# EAGLE board CNC (EAGLE 9.2.0)
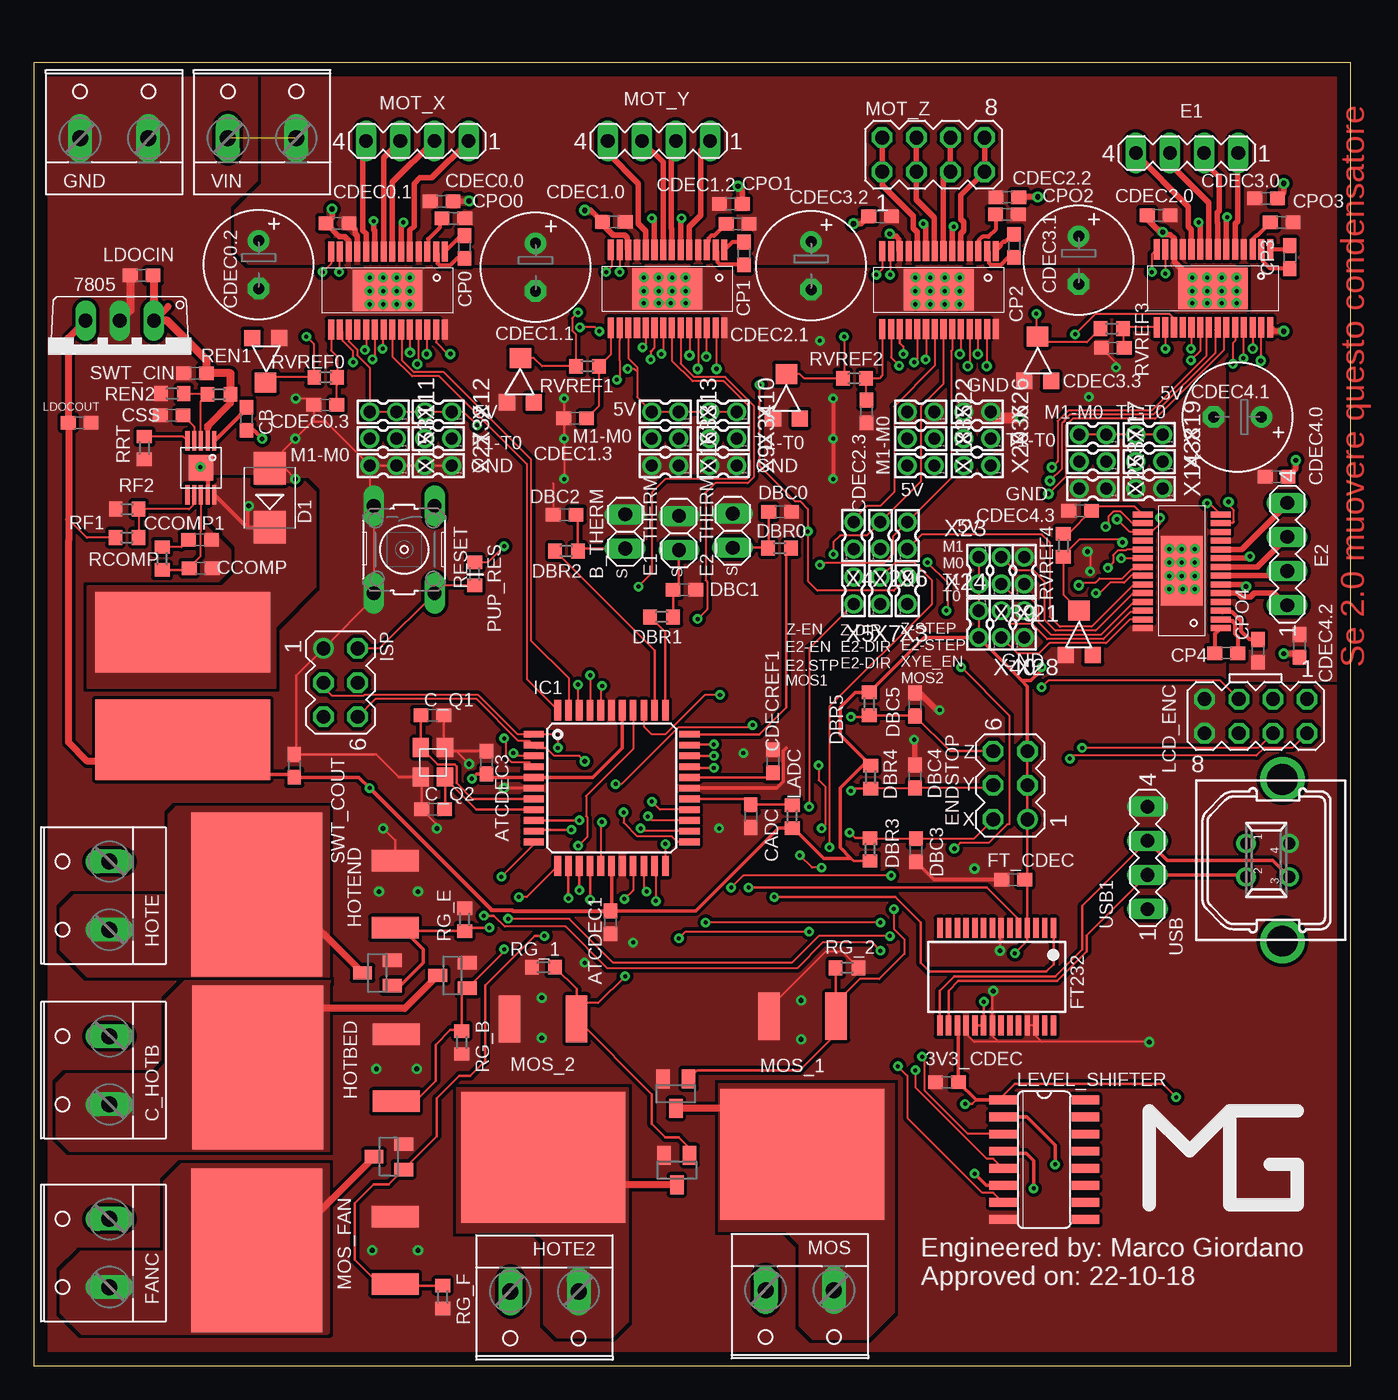
[diagram p2: board, top side]
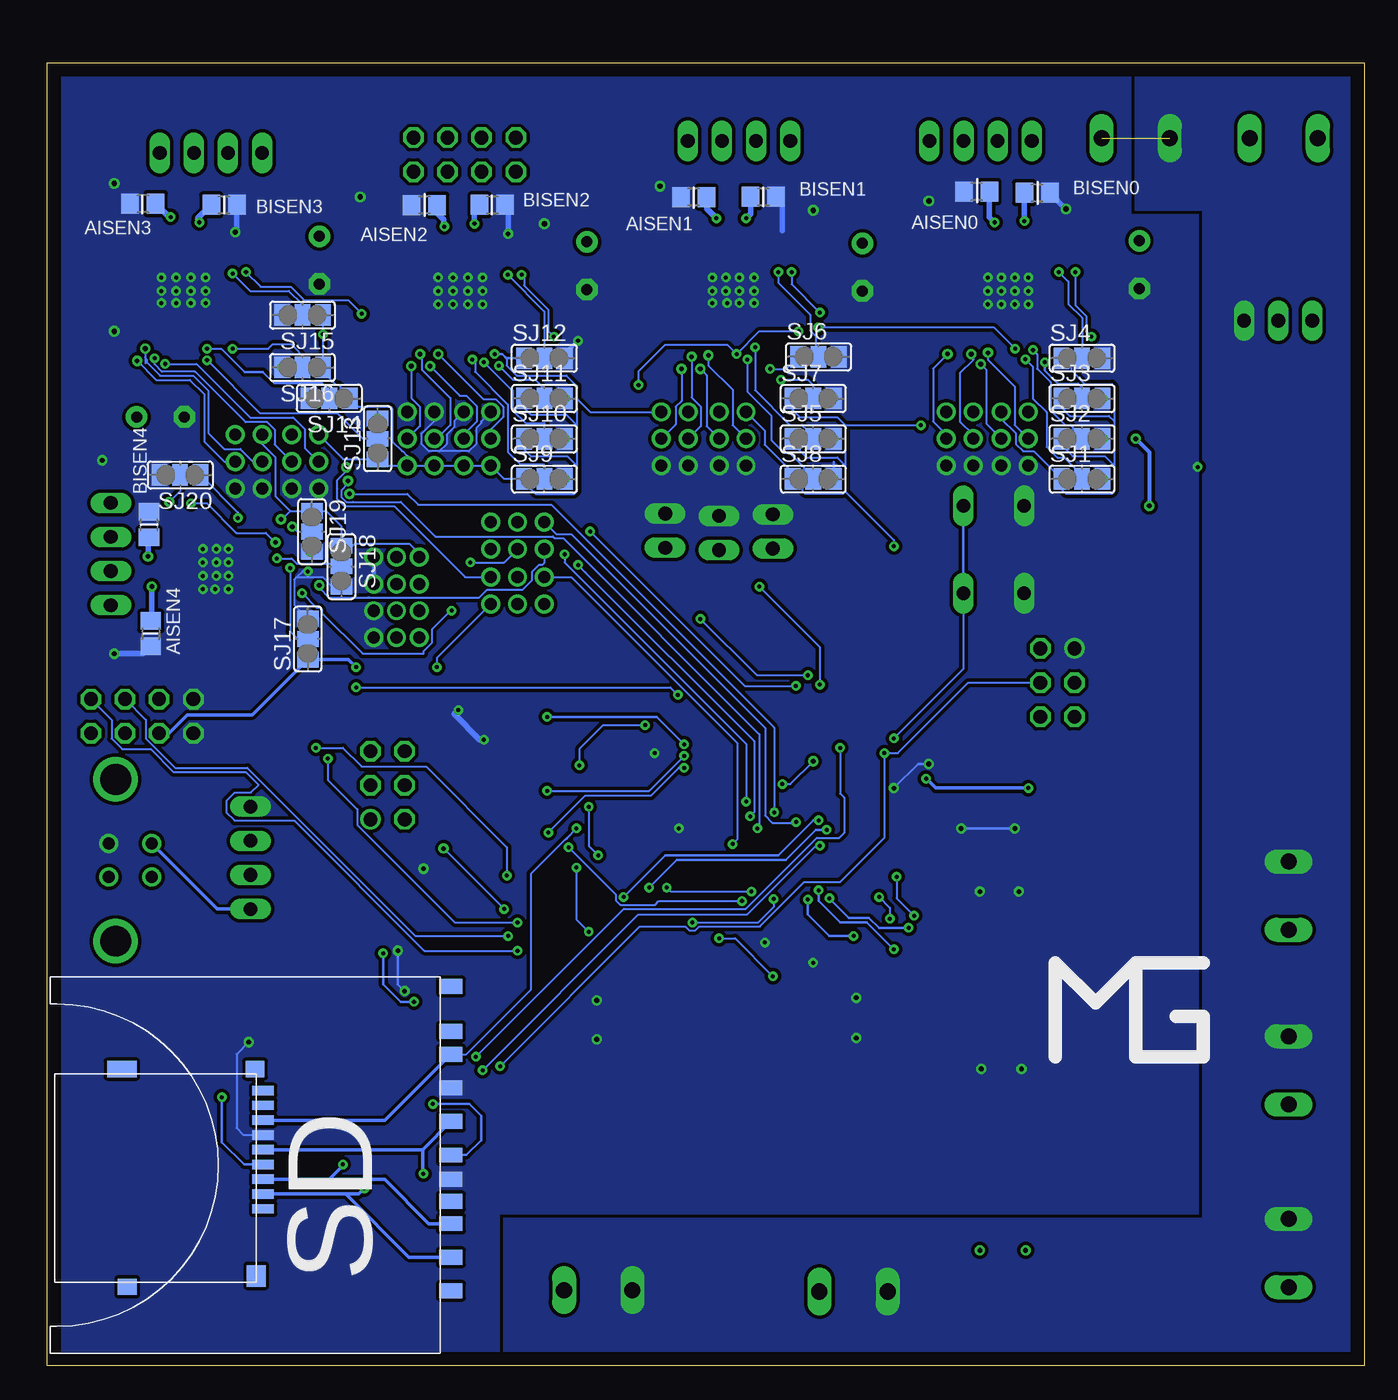
[diagram p3: board, bottom side, seen from below]

Size 98 x 97 mm. Coordinates in mm from the lower left corner, seen from the top.
Outline: 0,0 98,0 98,97 0,97 0,0
Copper layers (1*16): Top 0.035mm / dielectric 1.5mm / Bottom 0.035mm
Design rules "default *": minimum track width 6mil, minimum drill 0.3mm, track to track 6mil, track to pad 6mil, pad to pad 6mil, via to via 6mil, smd to smd 6mil, copper to edge 40mil, drill to drill 6mil, minimum pad ring 10mil, minimum via ring 8mil, stop-mask expansion 4mil, vias tented up to drill 0mil, thermal gap 10mil
Net classes: 0 default: width 0.152 mm, clearance 0.152 mm; 1 PowerIn: width 0.254 mm, clearance 0.152 mm

## Footprints (pad centres in the part's own frame; a part is rotated, then mirrored left to right if it is on the bottom)
C0603 = smd 1.1 x 1: 1 -0.85,0; 2 0.85,0
TO220V = drill 1.016 long: 1 -2.54,-2.54; 2 0,-2.54; 3 2.54,-2.54
R0805 = smd 1.3 x 1.5: 1 -0.95,0; 2 0.95,0
1X02 = drill 1.016 long: 1 -1.27,0; 2 1.27,0
W237-132 = drill 1.194 long: 1 -2.54,-0.635; 2 2.54,-0.635
E3,5-8 = drill 0.813 pad 1.6: + -1.778,0 | drill 0.813 pad 1.6 octagon: - 1.778,0
SMB = smd 2.4 x 2.4: A 2.2,0; C -2.2,0
R0603 = smd 1 x 1.1: 1 -0.85,0; 2 0.85,0
MA04-1 = drill 1.016 long: 1 -3.81,0; 2 -1.27,0; 3 1.27,0; 4 3.81,0
MA03-2 = drill 1.016: 1 -2.54,-1.27 | drill 1.016 octagon: 2 -2.54,1.27; 3 0,-1.27; 4 0,1.27; 5 2.54,-1.27; 6 2.54,1.27
HTSSOP = smd 1.5 x 0.45: AISEN -2.9,1; AOUT1 -2.9,1.65; AOUT2 -2.9,0.35; ATE -2.9,-3.55; BISEN -2.9,-0.95; BOUT1 -2.9,-1.6; BOUT2 -2.9,-0.3; CPH -2.9,3.6; CPL -2.9,4.25; DECAY0 2.9,-0.95; DECAY1 2.9,-1.6; DIR 2.9,0.35; ENABLE 2.9,-0.3; GND -2.9,-2.9; GND1 2.9,4.25; M0 2.9,2.3; M1 2.9,1.65; NFAULT 2.9,-2.25; NSLEEP 2.9,-2.9; STEP 2.9,1; TOFF 2.9,-3.55; TRQ0 2.9,3.6; TRQ1 2.9,2.95; V3P3 2.9,-4.2; VCP -2.9,2.95; VM -2.9,2.3; VM1 -2.9,-2.25; VREF -2.9,-4.2 | smd 3.1 x 5.18: GND2 0,0
SSOP28 = smd 0.4 x 1.5: 1 -4.225,-3.625; 2 -3.575,-3.625; 3 -2.925,-3.625; 4 -2.275,-3.625; 5 -1.625,-3.625; 6 -0.975,-3.625; 7 -0.325,-3.625; 8 0.325,-3.625; 9 0.975,-3.625; 10 1.625,-3.625; 11 2.275,-3.625; 12 2.925,-3.625; 13 3.575,-3.625; 14 4.225,-3.625; 15 4.225,3.625; 16 3.575,3.625; 17 2.925,3.625; 18 2.275,3.625; 19 1.625,3.625; 20 0.975,3.625; 21 0.325,3.625; 22 -0.325,3.625; 23 -0.975,3.625; 24 -1.625,3.625; 25 -2.275,3.625; 26 -2.925,3.625; 27 -3.575,3.625; 28 -4.225,3.625
SOT23 = smd 1 x 1.4: 1 -0.95,-1.1; 2 0.95,-1.1; 3 0,1.1
D2PAK = smd 9.75 x 12.2: D 0,0 | smd 3.5 x 1.6: G 10.3,-2.5; S 10.3,2.5
TQFP44 = smd 1.5 x 0.5: 1 -5.8,4; 2 -5.8,3.2; 3 -5.8,2.4; 4 -5.8,1.6; 5 -5.8,0.8; 6 -5.8,0; 7 -5.8,-0.8; 8 -5.8,-1.6; 9 -5.8,-2.4; 10 -5.8,-3.2; 11 -5.8,-4; 23 5.8,-4; 24 5.8,-3.2; 25 5.8,-2.4; 26 5.8,-1.6; 27 5.8,-0.8; 28 5.8,0; 29 5.8,0.8; 30 5.8,1.6; 31 5.8,2.4; 32 5.8,3.2; 33 5.8,4 | smd 0.5 x 1.5: 12 -4,-5.8; 13 -3.2,-5.8; 14 -2.4,-5.8; 15 -1.6,-5.8; 16 -0.8,-5.8; 17 0,-5.8; 18 0.8,-5.8; 19 1.6,-5.8; 20 2.4,-5.8; 21 3.2,-5.8; 22 4,-5.8; 34 4,5.8; 35 3.2,5.8; 36 2.4,5.8; 37 1.6,5.8; 38 0.8,5.8; 39 0,5.8; 40 -0.8,5.8; 41 -1.6,5.8; 42 -2.4,5.8; 43 -3.2,5.8; 44 -4,5.8
INDUCTOR = smd 6 x 13: 1 -4,0; 2 4,0
MA04-2 = drill 1.016 octagon: 1 -3.81,-1.27; 2 -3.81,1.27; 3 -1.27,-1.27; 4 -1.27,1.27; 5 1.27,-1.27; 6 1.27,1.27; 7 3.81,-1.27; 8 3.81,1.27
SO16 = smd 0.66 x 2.032: 1 -4.445,-3.073; 2 -3.175,-3.073; 3 -1.905,-3.073; 4 -0.635,-3.073; 5 0.635,-3.073; 6 1.905,-3.073; 7 3.175,-3.073; 8 4.445,-3.073; 9 4.445,3.073; 10 3.175,3.073; 11 1.905,3.073; 12 0.635,3.073; 13 -0.635,3.073; 14 -1.905,3.073; 15 -3.175,3.073; 16 -4.445,3.073
B3F-10XX = drill 1.016 long: 1 -3.251,2.261; 2 3.251,2.261; 3 -3.251,-2.261; 4 3.251,-2.261
SD_CARD = smd 1.1 x 1.7: CD 2.7,14.8; CLK -3.25,14.8; CMD 4.35,14.8; DAT0 -8.25,14.8; DAT1 -9.95,14.8; DATA2 9.35,14.8; DATA3 6.85,14.8; VDD -0.75,14.8; VSS1 1.05,14.8; VSS2 -5.75,14.8; WP -13.3,14.8
SJ_2 = smd 1.168 x 1.6: 1 -1.524,0; 2 0,0; 3 1.524,0
MSOP = smd 0.3 x 1.45: 1 -1,-2; 2 -0.5,-2; 3 0,-2; 4 0.5,-2; 5 1,-2; 6 1,2; 7 0.5,2; 8 0,2; 9 -0.5,2; 10 -1,2 | smd 1.83 x 1.89: GND 0,0
TRIMMER = smd 1.2 x 1.2: 1 -1,-1.6; 2 1,-1.6 | smd 1.6 x 1.5: 3 0,1.7
KUSBVX-BS1N = drill 0.9 pad 1.422: 1 1.25,2.7; 2 -1.25,2.7; 3 -1.25,-0.5; 4 1.25,-0.5 | drill 2.3 pad 2.7: M1 -6.02,0; M2 6.02,0
MICRO-SD = smd 0.7 x 1.6: 1 2.3,8; 2 1.2,8; 3 0.1,8; 4 -1,8; 5 -2.1,8; 6 -3.2,8; 7 -4.3,8; 8 -5.4,8; CD -6.5,8 | smd 1.6 x 1.4: P$1 7.3,7.5 | smd 1.2 x 1.4: P$2 -8.1,7.4; P$3 8.1,-2.1 | smd 1.2 x 2.2: P$4 -8.1,-2.5
SMD-3225_4P = smd 1.4 x 1.2: GND1 -1.1,0.9; GND2 1.1,-0.9; X1 -1.1,-0.9; X2 1.1,0.9
332-02 = drill 0.9 pad 1.27: 1 0,-1; 2 0,1
87758-0216 = drill 0.9 pad 1.27: 1 0,-1; 2 0,1

## Placement (x,y rotation side)
3V3_CDEC  0.1uF  [C0603]  67.95,21.11 180 top
7805  7805TV  [TO220V]  6.41,75.25 180 top
AISEN0  0R1 0W5  [R0805]  28.85,87.39 180 bottom
AISEN1  0R1 0W5  [R0805]  49.89,86.99 180 bottom
AISEN2  0R1 0W5  [R0805]  69.93,86.39 180 bottom
AISEN3  0R1 0W5  [R0805]  90.87,86.49 180 bottom
AISEN4  0R1 0W5  [R0805]  90.29,54.49 270 bottom
ATCDEC1  0.1uF  [C0603]  42.91,33.02 90 top
ATCDEC3  0.1uF  [C0603]  33.7,44.9 270 top
B_THERM  [1X02]  44.01,62.1 90 top
BISEN0  0R1 0W5  [R0805]  24.35,87.31 0 bottom
BISEN1  0R1 0W5  [R0805]  44.71,87.01 0 bottom
BISEN2  0R1 0W5  [R0805]  64.87,86.41 0 bottom
BISEN3  0R1 0W5  [R0805]  84.83,86.41 0 bottom
BISEN4  0R1 0W5  [R0805]  90.41,62.61 90 bottom
C_HOTB  [W237-132]  5,22 90 top
C_Q1  15pF  [C0603]  29.67,48.43 0 top
C_Q2  15pF  [C0603]  29.72,41.43 0 top
CADC  0.1uF  [C0603]  53.35,40.92 270 top
CB  0.1uF  [C0603]  15.83,70.48 270 top
CCOMP  6.8pF  [C0603]  12.43,59.37 180 top
CCOMP1  5.6nF  [C0603]  12.38,61.47 180 top
CDEC0.0  0.1uF-50v  [C0603]  30.35,86.67 0 top
CDEC0.1  0.1uF-50v  [C0603]  22.61,85.03 180 top
CDEC0.2  100uF-50v  [E3,5-8]  16.74,81.96 270 top
CDEC0.3  0.47uF  [C0603]  21.7,71.51 180 top
CDEC1.0  0.1uF-50v  [C0603]  43.17,85.13 180 top
CDEC1.1  100uF-50v  [E3,5-8]  37.34,81.77 270 top
CDEC1.2  0.1uF-50v  [C0603]  51.87,86.47 0 top
CDEC1.3  0.47uF  [C0603]  40.29,70.51 180 top
CDEC2.0  0.1uF-50v  [C0603]  83.69,85.63 180 top
CDEC2.1  100uF-50v  [E3,5-8]  57.84,81.88 270 top
CDEC2.2  0.1uF-50v  [C0603]  72.45,86.97 0 top
CDEC2.3  0.47uF  [C0603]  61.95,71.03 270 top
CDEC3.0  0.1uF-50v  [C0603]  91.69,86.87 0 top
CDEC3.1  100uF-50v  [E3,5-8]  77.74,82.29 270 top
CDEC3.2  0.1uF-50v  [C0603]  62.97,85.53 180 top
CDEC3.3  0.47uF  [C0603]  80.29,75.75 180 top
CDEC4.0  0.1uF-50v  [C0603]  92.47,66.17 0 top
CDEC4.1  100uF-50v  [E3,5-8]  89.56,70.61 180 top
CDEC4.2  0.1uF-50v  [C0603]  94.17,53.59 270 top
CDEC4.3  0.47uF  [C0603]  77.85,63.65 180 top
CDECREF1  0.1uF  [C0603]  55,45 270 top
CP0  0.1uF-50V  [C0603]  32.04,83.27 270 top
CP1  0.1uF-50v  [C0603]  52.85,82.79 270 top
CP2  0.1uF-50v  [C0603]  72.95,83.35 270 top
CP3  0.1uF-50v  [C0603]  93.45,82.51 270 top
CP4  0.1uF-50v  [C0603]  88.73,53.05 0 top
CPO0  0.47uF-16v  [C0603]  31.23,85.39 0 top
CPO1  0.47uF-16v  [C0603]  52.37,84.99 0 top
CPO2  0.47uF-16v  [C0603]  72.41,85.69 0 top
CPO3  0.47uF-16v  [C0603]  92.85,85.09 0 top
CPO4  0.47uF-16v  [C0603]  91.09,53.21 270 top
CSS  6.8nF  [C0603]  10.27,70.73 0 top
D1  2A  [SMB]  17.57,64.6 90 top
DBC0  4.7uF  [C0603]  55.54,63.55 0 top
DBC1  4.7uF  [C0603]  48.42,57.75 0 top
DBC2  4.7uF  [C0603]  39.5,63.35 180 top
DBC3  0.1uF  [C0603]  65.63,38.38 270 top
DBC4  0.1uF  [C0603]  65.57,43.87 90 top
DBC5  0.1uF  [C0603]  65.57,49.22 90 top
DBR0  10k  [R0603]  55.5,60.86 0 top
DBR1  10k  [R0603]  46.72,55.74 180 top
DBR2  10k  [R0603]  39.64,60.64 180 top
DBR3  10k  [R0603]  62.23,38.43 270 top
DBR4  10k  [R0603]  62.27,43.82 90 top
DBR5  10k  [R0603]  62.17,49.27 90 top
E1  [MA04-1]  85.81,90.26 180 top
E1_THERM  [1X02]  48.01,61.99 90 top
E2  [MA04-1]  93.26,60.42 90 top
E2_THERM  [1X02]  52.01,62.16 90 top
ENDSTOP  [MA03-2]  72.66,43.21 90 top
EXT_1  DRV8880  [HTSSOP]  87.74,80.19 270 top
EXT_2  DRV8880  [HTSSOP]  85.41,59.16 180 top
FANC  [W237-132]  5,8.4 90 top
FT232  FT232RL  [SSOP28]  71.65,28.96 180 top
FT_CDEC  0.1uF  [C0603]  72.88,36.19 0 top
GND  [W237-132]  6,92 0 top
HOTBED  BSS123  [SOT23]  31.17,29.06 90 top
HOTBED1  POWER_MOSFET  [D2PAK]  16.67,22.2 0 top
HOTE  [W237-132]  5,35 90 top
HOTE2  [W237-132]  38,4.9 180 top
HOTEND  BSS123  [SOT23]  25.57,29.25 90 top
HOTEND1  POWER_MOSFET  [D2PAK]  16.59,35.1 0 top
IC1  ATMEGA644A  [TQFP44]  43,43 0 top
ISP  [MA03-2]  22.84,50.85 270 top
L1  56uH  [INDUCTOR]  11.1,50.61 270 top
LADC  10uH  [R0603]  56.43,40.88 270 top
LCD_ENC  [MA04-2]  90.93,48.36 180 top
LDOCIN  0.33uF  [C0603]  8.04,81.15 180 top
LDOCOUT  0.1uF  [C0603]  3.42,70.19 0 top
LEVEL_SHIFTER  4050D  [SO16]  75.18,15.35 270 top
MOS  [W237-132]  57,5 180 top
MOS11  POWER_MOSFET  [D2PAK]  37.9,15.51 90 top
MOS22  POWER_MOSFET  [D2PAK]  57.2,15.73 90 top
MOS_1  BSS123  [SOT23]  47.86,14.57 180 top
MOS_2  BSS123  [SOT23]  47.78,20.27 180 top
MOS_FAN  BSS123  [SOT23]  26.43,15.57 90 top
MOS_FAN1  POWER_MOSFET  [D2PAK]  16.6,8.61 0 top
MOT_X  [MA04-1]  28.55,91.16 180 top
MOT_Y  [MA04-1]  46.52,91.16 180 top
MOT_Z  [MA04-2]  66.94,90.14 0 top
PUP_RES  10k  [R0603]  32.81,58.94 90 top
RCOMP  68.1k  [R0603]  9.56,60.09 270 top
REN1  105k  [R0603]  13.79,72.31 0 top
REN2  15.4k  [R0603]  10.32,72.36 0 top
RESET  [B3F-10XX]  27.57,60.75 270 top
RF1  56.2k  [R0603]  6.94,61.64 180 top
RF2  10k  [R0603]  6.96,63.76 0 top
RG_1  100k  [R0603]  37.93,29.67 180 top
RG_2  100k  [R0603]  60.52,29.63 0 top
RG_B  100k  [R0603]  31.85,24.07 270 top
RG_E  100k  [R0603]  32.07,33.22 90 top
RG_F  100k  [R0603]  30.43,5.13 270 top
RRT  442k  [R0603]  8.24,68.31 90 top
RVREF0  150k  [R0603]  21.73,73.57 180 top
RVREF1  150k  [R0603]  41.21,74.39 180 top
RVREF2  150k  [R0603]  61.06,73.49 180 top
RVREF3  150k  [R0603]  80.21,77.19 180 top
RVREF4  150k  [R0603]  76.61,61.06 270 top
SD  SD_CARD  [SD_CARD]  82.76,14.94 270 bottom
SJ1  [SJ_2]  21,66 0 bottom
SJ2  [SJ_2]  21,69 0 bottom
SJ3  [SJ_2]  21,72 0 bottom
SJ4  [SJ_2]  21,75 0 bottom
SJ5  [SJ_2]  41,69 0 bottom
SJ6  [SJ_2]  40.6,75.1 0 bottom
SJ7  [SJ_2]  41,72 0 bottom
SJ8  [SJ_2]  41,66 0 bottom
SJ9  [SJ_2]  61,66 0 bottom
SJ10  [SJ_2]  61,69 0 bottom
SJ11  [SJ_2]  61,72 0 bottom
SJ12  [SJ_2]  61,75 0 bottom
SJ13  [SJ_2]  73.4,69 90 bottom
SJ14  [SJ_2]  77,72 180 bottom
SJ15  [SJ_2]  79,78.2 180 bottom
SJ16  [SJ_2]  79,74.3 180 bottom
SJ17  [SJ_2]  78.6,54.1 90 bottom
SJ18  [SJ_2]  76.1,59.5 270 bottom
SJ19  [SJ_2]  78.3,62.1 270 bottom
SJ20  [SJ_2]  88.1,66.3 180 bottom
SUPPLY  TPS54160  [MSOP]  12.45,66.84 180 top
SWT_CIN  10uF  [C0603]  12.01,73.87 0 top
SWT_COUT  47uF  [C0603]  19.39,44.66 270 top
T0  100k  [TRIMMER]  17.27,74.89 180 top
T1  TRIMMER  [TRIMMER]  36.22,73.31 0 top
T2  TRIMMER  [TRIMMER]  56.01,72.11 0 top
T3  TRIMMER  [TRIMMER]  74.7,74.91 0 top
T4  TRIMMER  [TRIMMER]  77.79,54.51 0 top
USB  KUSBVX-BS1N  [KUSBVX-BS1N]  92.9,37.63 90 top
USB1  [MA04-1]  82.86,37.81 90 top
USD  MICRO-SD  [MICRO-SD]  89.93,13.99 270 bottom
VIN  [W237-132]  17,92 0 top
X1  20MHZ_CRYSTAL  [SMD-3225_4P]  29.71,44.92 270 top
X3  332-02  [332-02]  65,57.7 0 top
X4  332-02  [332-02]  61,61.8 0 top
X5  332-02  [332-02]  61,57.7 0 top
X6  332-02  [332-02]  65,61.8 0 top
X7  87758-0216  [87758-0216]  63,57.7 0 top
X9  87758-0216  [87758-0216]  51.3,67 90 top
X10  87758-0216  [87758-0216]  51.3,71 90 top
X11  87758-0216  [87758-0216]  26,71 90 top
X12  87758-0216  [87758-0216]  30.1,71 90 top
X13  87758-0216  [87758-0216]  47,71 90 top
X14  87758-0216  [87758-0216]  83,65.3 90 top
X15  87758-0216  [87758-0216]  26,67 90 top
X16  87758-0216  [87758-0216]  47,67 90 top
X17  87758-0216  [87758-0216]  78.8,69.3 90 top
X18  87758-0216  [87758-0216]  66,67 90 top
X19  87758-0216  [87758-0216]  83,69.3 90 top
X20  87758-0216  [87758-0216]  70.2,67 90 top
X21  87758-0216  [87758-0216]  73.7,59.2 0 top
X22  87758-0216  [87758-0216]  66,71 90 top
X23  87758-0216  [87758-0216]  70.3,59.2 180 top
X24  87758-0216  [87758-0216]  70.3,55.2 180 top
X25  87758-0216  [87758-0216]  78.8,65.3 90 top
X26  87758-0216  [87758-0216]  70.2,71 90 top
X27  87758-0216  [87758-0216]  30.1,67 90 top
X28  87758-0216  [87758-0216]  73.7,55.2 0 top
X29  87758-0216  [87758-0216]  63,61.8 0 top
X31  87758-0216  [87758-0216]  26,69 90 top
X32  87758-0216  [87758-0216]  30.1,69 90 top
X33  87758-0216  [87758-0216]  47,69 90 top
X34  87758-0216  [87758-0216]  51.3,69 90 top
X35  87758-0216  [87758-0216]  66,69 90 top
X36  87758-0216  [87758-0216]  70.2,69 90 top
X37  87758-0216  [87758-0216]  78.8,67.3 90 top
X38  87758-0216  [87758-0216]  83,67.3 90 top
X39  87758-0216  [87758-0216]  72,59.2 0 top
X40  87758-0216  [87758-0216]  72,55.2 0 top
X_AXIS  DRV8880  [HTSSOP]  26.34,80.03 270 top
Y-AXIS  DRV8880  [HTSSOP]  47.14,80.15 270 top
Z_AXIS  DRV8880  [HTSSOP]  67.34,80.07 270 top

## Tracks (layer width: path | path; a pad name or v marks a point on that pad's centre or on a via)
3V3  (via drill 0.3)
  Top 0.203: 70.11,19.8 69.82,19.5 v69.3,19.5 | v85,20 84,21 73,21 72,20 72,19.8
  Top 0.254: FT232.17 68.8,25.26 3V3_CDEC.1 70.11,19.8 72,19.8 LEVEL_SHIFTER.1
  Bottom 0.152: USD.4 83,14.99
  Bottom 0.203: v69.3,19.5 66.6,19.5 65.7,18.6 65.7,16.8 66.81,15.69 SD.VDD | USD.4 83,14.99 83.34,14.99 85,16.65 v85,20
5V  (via drill 0.3, 0.35)
  Top 0.152: X19.1 X19.2 X17.1 X17.2 | v77.48,76.77 78.97,78.27 84.51,78.27 84.84,77.94 EXT_1.NSLEEP | X24.2 X24.1 X23.2 X23.1 | X10.1 X10.2 X13.1 X13.2 44.9,72.1 44.9,74 | v33,70 32,71 X12.1 X12.2 X11.1 X11.2 25,74.3 24.07,75.23 24.07,75.63 23.44,76.26 X_AXIS.NSLEEP | v35,61 33.79,59.79 PUP_RES.2 | Y-AXIS.NSLEEP 44.24,75 44.9,74.34 44.9,74 | 64.44,76.13 64.7,75.87 v64.7,75.3 | 82.37,62.2 EXT_2.NSLEEP | 83.16,62.06 83,62.06 | 83,62.06 EXT_2.NSLEEP | 83.16,62.06 | v44.2,74.2 44.7,74.2 44.9,74 | v83.8,63.1 83.8,62.7 83.16,62.06 | RF1.2 3.97,61.64 2.61,63 2.6,62.99 2.6,61.4 | 43,33.87 ATCDEC1.2 43.01,33.97 43.01,35 | 42.89,33.89 43.02,34.02 | 42.91,33.89 43.98,33.89 44,33.87 | 82.94,62 83,62.06 | v80.6,63 81.5,62.1 82.47,62.1 EXT_2.NSLEEP
  Top 0.2: Z_AXIS.NSLEEP 64.44,76.13 | 56.53,40.03 LADC.2 | DBR3.2 61,37.58 60.8,37.78 | 62,45 62,44.94 DBR4.2 | ENDSTOP.5 ENDSTOP.3 ENDSTOP.1 73.92,36 FT232.4 73.92,31.62 v73,30.7 | v75,52 75,51.8 | FT232.20 FT232.19
  Top 0.203: FT_CDEC.2 73.92,36 | FT232.20 70.67,27.1 v70.7,27.1
  Top 0.254: v25,43 24.19,43.81 SWT_COUT.2 19.2,44 13.71,44 L1.2 | v32.6,43.7 32.95,44.05 ATCDEC3.2 33.95,43.8 IC1.5 41.6,43.8 43.8,46 IC1.38 | 43.02,34.02 43.01,35 IC1.17 | 43,33.87 44,33.87 49.27,33.87 55.43,40.03 LADC.2 | 56.53,40.03 58.78,37.78 60.8,37.78 60,38.58 60,43 62,45 | DBR4.2 60,46.94 60,49 61.12,50.12 DBR5.2 66.25,54.2 X24.2 73.5,51 | ENDSTOP.5 73.93,50.57 73.5,51 | 75,51.8 74.2,51 73.5,51
  Top 0.305: 43,33.87 35.63,33.87 35.57,33.93 34.07,33.93 v25,43
  Top 0.508: 2.61,61.41 2.61,63 2.61,70.23 LDOCOUT.1 2.57,76.49 7805.3 | 2.6,61.4 2.6,46.4 4,45 9.49,45 L1.2
  Bottom 0.152: X19.2 82,68.62 81.02,67.64 81.02,64.74 79.9,63.62 | X17.2 75.98,67.48 SJ13.1 | SJ18.1 75.68,60.61 75.11,61.18 71.06,61.18 70.28,60.4 70.28,60.22 X23.1 | 76.12,61.02 SJ18.1 | 72.92,67 X20.1 | X20.1 X20.2 X18.1 X18.2 64,66 SJ9.1 62.52,65.78 61.64,64.9 | 58.77,64.9 58.59,65.07 58.59,67 | 61.84,65.09 61.64,64.9 | 61.64,64.9 58.77,64.9 | 61.64,64.9 58.77,64.9 | 58.59,70 58.59,67 | 58.59,72 58.59,70 | 58.59,72 58.59,72.93 59.37,73.7 63.05,73.7 63.81,74.46 63.81,74.99 63.91,75.09 | 58.59,70 59.39,70.8 62,70.8 62.52,71.32 SJ11.1 | 58.59,67 59.29,67.7 62,67.7 62.52,68.22 SJ10.1 | 38.61,65.08 38.78,64.92 41.63,64.92 41.81,65.11 41.81,65.29 SJ8.1 42.52,66.47 44.62,68.56 44.62,69.62 X13.2 | 38.61,67 38.61,65.08 | 38.61,70 38.61,67 | 38.61,70 39.21,70.6 42,70.6 42.52,71.12 SJ7.1 | 38.61,67 39.21,67.6 41.5,67.6 42.52,68.62 SJ5.1 | 38.61,70 v33,70 | 38.61,65.08 35,61.47 v35,61 | SJ4.1 21.81,74.29 21.81,74.11 20.79,73.08 18.78,73.08 18.61,72.92 18.61,70.3 | 18.61,70.3 18.61,67 | 18.61,67 18.61,65.08 18.78,64.92 22.22,64.92 22.6,65.3 22.52,65.38 SJ1.1 24.59,68.07 25.39,68.07 25.93,68.61 25.93,69.41 27,70.48 X11.1 | SJ3.1 22.52,71.32 21.9,70.7 19.01,70.7 18.61,70.3 | 18.61,67 19.31,67.7 21.7,67.7 22.52,68.52 SJ2.1 | X10.1 57.59,71 58.59,72 | X20.1 71.2,67.72 71.54,68.07 71.59,68.07 72.32,68.8 72.32,71.22 72.48,71.39 74.86,71.39 SJ14.1 76.19,72.71 76.19,72.89 76.32,73.03 76.5,73.03 77.48,74 SJ16.1 v77.48,76.77 SJ15.1 | SJ18.1 76.1,62.5 77.22,63.62 SJ19.1 79.9,63.62 | SJ6.1 43.02,74.2 v44.2,74.2 | SJ20.1 83.8,63.52 v83.8,63.1 | SJ17.1 78,52.58 | 79.9,63.62 80.52,63 v80.6,63
  Bottom 0.2: 78,69.3 X17.2 | SJ13.1 72.92,67 | v73,30.7 73,28.4 | SJ12.1 63.82,75 63.91,75.09 64.12,75.3 v64.7,75.3
  Bottom 0.203: 73,28.4 71.7,27.1 v70.7,27.1
  Bottom 0.254: v25,43 31.9,43 v32.6,43.7 | v75,52 75.58,52.58 78,52.58 SJ17.1 82.72,48.45 87.56,48.45 88.93,47.09 LCD_ENC.6
ATE.0  (via drill 0.3)
  Top 0.152: v22.72,81.4 22.72,82.86 X_AXIS.ATE
  Bottom 0.152: SJ4.2 21,78 22.02,79.02 22.02,80.7 v22.72,81.4
ATE.1  (via drill 0.3)
  Top 0.152: Y-AXIS.ATE v43.59,81.41 v43.6,81.4
  Bottom 0.152: SJ6.2 40.8,75.3 40.8,76.64 41.22,77.06 41.22,78.22 43.6,80.6 v43.6,81.4
ATE.2  (via drill 0.3)
  Top 0.152: v63.72,81.2 63.72,82.9 Z_AXIS.ATE
  Bottom 0.152: SJ12.2 61,78.48 v63.72,81.2
ATE.3  (via drill 0.3)
  Top 0.152: EXT_1.ATE v84.19,81.31 v84.2,81.3
  Bottom 0.152: v84.2,81.3 82.9,80 80,80 79,79 SJ15.2
ATE.4  (via drill 0.35)
  Top 0.152: v88.9,64.3 88.9,64.07 89.29,63.68 89.29,62.81 89.3,62.8 89.21,62.71 EXT_2.ATE
  Bottom 0.152: v88.9,64.3 88.1,65.1 SJ20.2
AVCC
  Top 0.2: IC1.27 52.92,42.2 CADC.1 56.39,41.77 LADC.1
B0.1
  Top 0.406: X_AXIS.BOUT1 24.74,84.26 24.5,84.5 24.5,90.92 MOT_X.4
B0.2
  Top 0.406: X_AXIS.BOUT2 26.04,89.92 MOT_X.3
B1.1
  Top 0.406: Y-AXIS.BOUT1 45.54,84.46 45,85 45,88 42.71,90.29 MOT_Y.4
B1.2
  Top 0.406: Y-AXIS.BOUT2 46.84,84.42 46.83,84.43 46.83,89.58 MOT_Y.3
B2.1
  Top 0.406: Z_AXIS.BOUT1 65.72,82.99 65.72,84.39 65.44,84.67 65.44,85.56 63.13,87.87 MOT_Z.1 MOT_Z.2
B2.2
  Top 0.406: Z_AXIS.BOUT2 67.02,82.99 67.02,85.45 65.67,86.8 MOT_Z.3 MOT_Z.4
B3.1
  Top 0.406: EXT_1.BOUT1 86.14,84.56 85.91,84.78 85.91,86.29 82,90.2 E1.4
B3.2
  Top 0.406: E1.3 84.54,89.46 87.43,86.57 87.43,84.33 87.44,84.32 EXT_1.BOUT2
B4.1
  Top 0.406: EXT_2.BOUT1 89.89,60.76 93.26,64.13 E2.4
B4.2
  Top 0.406: EXT_2.BOUT2 91.03,59.46 E2.3
B-THERM
  Top 0.2: DBR2.2 46.2,53.23 IC1.35
CLK-ENC  (via drill 0.3)
  Top 0.152: LCD_ENC.5 88.29,51 75.5,51 v75,50.5 | v51.06,49.94 49.94,49.94 47,47 46,47 45.4,47.6 IC1.36
  Bottom 0.152: v75,50.5 51.63,50.5 v51.06,49.94
CS_3V3  (via drill 0.3)
  Top 0.254: v74.4,13.2 74.4,15.27 73.83,15.83 72.26,15.83 LEVEL_SHIFTER.4
  Bottom 0.254: SD.DATA3 71.09,8.09 75.79,12.79 | USD.2 75.79,12.79 | 75.79,12.79 74.81,12.79 v74.4,13.2
D0.0  (via drill 0.3)
  Top 0.152: X_AXIS.DECAY0 25.39,75.09 v25.21,74.91
  Bottom 0.152: SJ1.2 21.01,66.3 22.32,67.6 22.83,67.6 23.64,68.41 23.64,70.98 24.65,71.99 24.65,74.35 v25.21,74.91
D0.1  (via drill 0.3)
  Top 0.152: v45.9,74.89 45.9,75.5 46.19,75.79 Y-AXIS.DECAY0
  Bottom 0.152: SJ8.2 41.71,66.71 41.71,66.89 42.79,67.97 43.2,67.97 44.12,68.88 44.12,70.72 45.9,72.5 v45.9,74.89
D0.2  (via drill 0.3)
  Top 0.152: Z_AXIS.DECAY0 66.39,74.93 v66.36,74.9
  Bottom 0.152: v66.36,74.9 66.16,74.7 66.16,73.99 63.71,71.54 63.71,68.01 62.8,67.1 61.1,67.1 61,67 SJ9.2
D0.3  (via drill 0.3)
  Top 0.152: EXT_1.DECAY0 86.79,75.53 v86.1,74.84
  Bottom 0.152: v86.1,74.84 82.16,70.9 76.4,70.9 74.5,69 SJ13.2
D0.4  (via drill 0.3)
  Top 0.152: v80.9,60.1 EXT_2.DECAY0
  Bottom 0.152: SJ18.2 76.31,59.71 79.42,59.71 79.8,60.1 v80.9,60.1
D1.0  (via drill 0.3)
  Top 0.152: X_AXIS.DECAY1 24.74,75.69 v24.65,75.6
  Bottom 0.152: SJ2.2 21.71,69.71 21.71,69.89 21.84,70.03 22.26,70.03 23.34,71.11 23.34,73.2 24.35,74.21 24.35,75.3 v24.65,75.6
D1.1  (via drill 0.3)
  Top 0.152: v45.31,75.81 45.54,76.04 Y-AXIS.DECAY1
  Bottom 0.152: SJ5.2 40.9,69.1 40.9,69.6 41.42,69.6 41.84,70.03 42.73,70.03 45.31,72.61 v45.31,75.81
D1.2  (via drill 0.3)
  Top 0.152: Z_AXIS.DECAY1 65.74,74.94 v65.5,74.7
  Bottom 0.152: SJ10.2 61,70.17 62.4,70.17 63.34,71.11 63.34,72.61 63.41,72.61 v65.5,74.7
D1.3  (via drill 0.3)
  Top 0.152: EXT_1.DECAY1 86.14,75.74 v86.1,75.7
  Bottom 0.152: v86.1,75.7 85.02,75.7 83.29,73.97
  Bottom 0.2: 83.29,73.97 81.94,73.97 81.11,73.15 77.55,73.15 77,72.6 SJ14.2
D1.4  (via drill 0.3)
  Top 0.152: 82.45,60.7 EXT_2.DECAY1 81.33,60.76 81.26,60.68 80.66,60.68 80.32,60.34 80.32,59.79 v79.91,59.39
  Bottom 0.152: SJ17.2 79.36,54.1 79.91,54.66 v79.91,59.39
D+
  Top 0.203: USB1.3 78,34.22 78,31 76,29 68.5,29 67.4,27.9 67.4,25.36 FT232.15
  Top 0.254: USB1.3 84.34,37.6 92.18,37.6 USB.3
D-
  Top 0.203: USB1.2 78.36,32.04 78.36,30.85 76.15,28.64 68.8,28.64 68.08,27.92 FT232.16
  Top 0.254: USB.2 90.04,36.54 USB1.2
E2-DIR  (via drill 0.3)
  Top 0.152: X7.2 64.1,59.8 65.5,59.8 66.8,58.5 66.8,56.66 59.2,49.06 v59.2,38.6 | IC1.21 46.3,37.1 v46.3,34.6
  Bottom 0.152: v46.3,34.6 52.48,34.6 52.76,34.32 55.34,34.32 55.68,34.66 55.68,35.08 v59.2,38.6
E2-DIR-C  (via drill 0.3)
  Top 0.152: v66.5,59.8 68,58.3 68,56.3 v67.9,56.2 | EXT_2.DIR 81.64,58.81 81.13,58.3 80.09,58.3 79.3,57.5 v79.03,57.5
  Bottom 0.152: v67.9,56.2 67.98,56.2 69.37,54.81 69.37,53.81 70,53.18 70,53 74.52,53 77.57,56.05 77.57,56.3 77.7,56.44 77.96,56.44 v79.03,57.5 | X29.1 64,59.8 v66.5,59.8
E2-STEP  (via drill 0.3)
  Top 0.152: v47,38.84 47,38 IC1.22 | IC1.22
  Top 0.254: v47,38.84
  Bottom 0.152: X5.2 59.01,58.7 46.65,46.35 46.65,39.18 v47,38.84
E2-STEP-C
  Top 0.152: X6.1 66.08,61.88 75.01,61.88 75.59,61.3 75.59,55.77 76.34,55.02 78.72,55.02 81.86,58.16 81.94,58.16 | 81.94,58.16 81.9,58.2 | EXT_2.STEP 81.94,58.16
E2-THERM
  Top 0.2: DBR0.2 56,60.51 56,49 54,47 IC1.33
E2_EN_C  (via drill 0.35)
  Top 0.152: EXT_2.ENABLE 82.31,59.26 81.67,59.26 81,58.6 79.3,58.6 79,58.3 77.96,58.3 v77.75,58.09
  Bottom 0.152: X4.1 61,59.77 61.13,59.63 61.39,59.63 61.93,59.09 61.93,58.45 62.61,57.77 65.25,57.77 65.83,57.18 74,57.18 | 74.11,57.18 74,57.18 | 74,57.18 74.02,57.16 77,57.16 77.75,57.92 v77.75,58.09
E-DIR  (via drill 0.3, 0.35)
  Top 0.152: EXT_1.DIR 87.89,77.09 87.89,75.38 83.31,70.8 77.1,70.8 76.7,70.4 76.7,70.33 76.5,70.13 76.5,66.75 v75.61,65.87 | 48.7,39.9 IC1.24 45.36,39.8 v45.16,40
  Bottom 0.152: v45.16,40 45,40.16 45,47 59.59,61.59 60.23,61.59 60.36,61.73 69.11,61.73 71.68,64.3 75.24,64.3 75.25,64.29 75.75,64.29 76.11,64.65 76.11,65.15 75.61,65.65 v75.61,65.87
E-STEP  (via drill 0.3, 0.35)
  Top 0.152: EXT_1.STEP 88.54,77.09 88.54,75.6 83.44,70.5 77.3,70.5 76.8,70 76.8,66.2 v75.5,64.9 | IC1.23 47.9,39 47.48,39.42 44.92,39.42 43.9,40.44 v43.9,41.2
  Bottom 0.152: v43.9,41.2 43.9,47.5 60.5,64.1 70.4,64.1 71.2,64.9 v75.5,64.9
E-THERM
  Top 0.2: DBR1.2 47,54.61 IC1.34
ENC1  (via drill 0.3)
  Top 0.152: 34.25,33.5 v33.5,33.5 | 34.25,33.5 35.06,32.69 39.58,32.69 42.67,29.6 56.8,29.6 58.7,31.5 62.4,31.5 v63,30.9 | v34.8,36.4 37.2,38.8 IC1.11 | v33.5,33.5 | v33.5,33.5 34.25,33.5
  Bottom 0.152: LCD_ENC.1 93.19,48.08 93.19,46.68 92.41,45.9 90.3,45.9 88.6,44.2 83.23,44.2 82.27,43.23 82.84,42.66 84.05,42.66 84.66,42.05 84.66,41.19 84.05,40.58 79.61,40.58 69.93,30.9 v63,30.9 | v33.5,33.5 34.8,34.8 v34.8,36.4
ENC2  (via drill 0.3)
  Top 0.152: IC1.12 36.7,34.9 v36.1,34.9 | v35.3,33.27 39.85,33.27 43.12,30 56.4,30 58.4,32 v63.7,32
  Bottom 0.152: v36.1,34.9 35.3,34.1 v35.3,33.27 | v63.7,32 70.6,32 83.1,44.5 88.47,44.5 90.65,46.68 90.65,48.08 LCD_ENC.3
FAN  (via drill 0.3)
  Top 0.203: RG_F.1 27.03,5.98 MOS_FAN1.G 25.69,6.11 23.9,7.9 23.9,12.1 25.3,13.5 26.41,13.5 MOS_FAN.1 30,17.09 30,19.93 31.68,21.6 32.5,21.6 33.6,22.7 33.6,28.3 37.3,32 v38,32 | IC1.15 v41.4,34.7
  Bottom 0.203: v41.4,34.7 41.4,33.6 39.8,32 v38,32
GND  (via drill 0.3, 0.35, 0.4)
  Top 0.152: v19.5,72 20.36,72 CDEC0.3.2 20.85,70.37 20.74,70.26 SJ2.3 17.57,67.09 D1.A 18.68,66.8 SJ1.3 | 38.65,65.67 DBC2.2 | SJ5.3 SJ8.3 | RG_2.2 60.2,30.8 58.9,30.8 54.7,26.6 MOS22.S | v83,24.1 75,24.1 | 75,24.1 74.5,24.6 74.58,24.68 FT232.26 FT232.25 | 75,24.1 71.8,24.1 | 71.8,24.1 69.99,24.1 69.6,24.49 69.6,24.5 69.38,24.73 FT232.18 | FT232.21 71.33,24.57 71.8,24.1 | v78.6,59.13 78.6,60.41 78.52,60.49 | X15.2 25,64.31 RESET.3 RESET.4 | v84,84.37 83.8,84.37
  Top 0.2: FT232.21 71.33,27.82 v71.4,27.9 | v71.9,30.9 71.9,32.51 FT232.7 | 20.74,70.26 21.74,70.26 X15.2 X15.1 X27.2 X27.1 | HOTEND1.S 26.89,39.11 v26,40 | v30,40 30,40.3 C_Q2.1 28.87,43.76 X1.GND2 27.18,43.82 25.49,45.51 SWT_COUT.1 19.56,45.68 19.56,51.38 ISP.1 25.31,57.13 RESET.4 | C_Q1.2 30.52,46.11 X1.GND1 30.88,45.75 31.45,45.75 | ATCDEC3.1 31.45,45.75 | IC1.6 v35,43 | v32.4,44.8 31.45,45.75 | CDEC3.3.2 80.52,74.67 SJ16.3 | CDEC1.3.2 39.48,70.47 SJ5.3 SJ7.3
  Top 0.254: DBC3.2 66.97,36.19 FT_CDEC.1 | 56,46 55.78,45.78 55.78,43.48 55.3,43 IC1.28
  Top 0.305: SUPPLY.9 12.95,66.34 SUPPLY.GND | SJ9.3 59.48,68.88 59.5,68.9 59.48,68.92 SJ10.3 SJ11.3
  Top 0.406: Z_AXIS.GND 64.37,83.04 64.37,83.87 64.16,84.08 63.88,84.08 v63.7,84.25 | EXT_1.GND2 87.53,80.4 85.6,80.4 85.6,81.43 84.86,82.17 84.86,83.07 EXT_1.GND 84.84,83.92 84.56,84.2 84.17,84.2 v84,84.37 83.8,84.37 82.84,85.33 CDEC2.0.2 | DBC4.2 65.57,46.53 v65.5,46.6 | v67.4,48.8 67.2,48.8 65.93,50.07 DBC5.2 | X_AXIS.GND 23.44,83.76 23.16,84.04 22.75,84.04 CDEC0.1.2 22.2,85.47 v22.2,86.1 | Y-AXIS.GND 44.17,83.12 44.17,83.95 43.96,84.16 43.13,84.16 42.32,84.97 CDEC1.0.2 41.45,86 v41,86 | v32.4,86.7 32.37,86.67 CDEC0.0.2 | CDEC1.2.2 52.72,87.48 v52.4,87.8 | CDEC2.2.2 73.33,87 v74.7,87 | CDEC3.0.2 93,87.33 v93,88 | EXT_1.GND1 92.28,77 v93,77 | CDEC3.2.2 61.59,85 v61,85 | CDEC4.2.2 93.91,53 v93,53 | CDEC4.0.2 93.9,66.75 v93.9,67.4
  Top 0.61: 7805.2 7.19,78.57 LDOCIN.2
  Top 0.813: X26.1 71.68,70.52 SJ13.3
  Bottom 0.152: v19.5,72 SJ3.3 | USD.6 83.39,17.19 83.9,17.7 83.9,23.2 v83,24.1 | SJ12.3 59,75 | 76.5,58.38 SJ18.3 76.78,57.98 77.5,58.7 79.41,58.7 | 79.3,56.1 78.82,55.62 SJ17.3 79.61,56.63 79.61,58.5 79.41,58.7 | 79.41,58.7 78.98,59.13 v78.6,59.13 | 78.52,60.49 78.43,60.58 SJ19.3 | 68.81,68.07 68.27,68.61 68.27,69.3 67.69,69.87 67.69,70.31 X22.1 | 68.81,68.07 69.59,68.07 70.13,68.61 70.13,69.39 69.2,70.32 X26.2 | X22.2 65.71,70.29 65.71,70.17 66.07,69.81 66.07,68.61 66.61,68.07 68.81,68.07
  Bottom 0.2: v71.4,27.9 71.9,28.4 v71.9,30.9 | v30,40 v26,40 | v35,43 33.2,44.8 v32.4,44.8 | 39.48,67.27 SJ8.3
  Bottom 0.254: 19.83,69 SJ2.3
  Bottom 0.305: SJ12.3 59.48,75.32 v58.5,76.3 | X21.2 X21.1
  Bottom 0.406: 43.3,84.5 43.3,86.55 BISEN1.2 | v84,84.37 83.88,84.49 BISEN3.2 | v63.7,84.25 63.7,86.19 BISEN2.2 | v65.5,46.6 65.8,46.6 67.7,48.5 v67.4,48.8 | v22.2,86.1 BISEN0.2 | AISEN4.2 90.83,53 v93,53
  other vias: 19.48,69 19.48,66 59.48,66 59.48,69 59.48,72 73.4,70.52 80.52,74.3 39.48,66 39.48,69 39.48,72 52.8,45.6 51,40 78.5,72.1 41,30 44.6,31.5 25,81 25,80 25,79 26,79 27,79 28,79 26,80 27,80 28,80 28,81 27,81 26,81 48.5,81 45.4,81 46.5,81 47.5,81 45.4,80 46.5,80 47.5,80 48.5,80 45.4,79.1 46.5,79.1 47.4,79.1 48.5,79.1 65.6,81 66.7,81 67.8,81 68.9,81 65.6,80 68.9,79 67.8,79 66.7,79 65.6,79 66.7,80 67.8,80 68.9,80 86.2,81 87.3,81 88.4,81 89.5,81 86.2,80 87.3,80 88.4,80 89.5,80 86.2,79.1 87.3,79.1 88.4,79.1 89.5,79.1 84.5,60.8 85.4,60.8 86.4,60.8 84.5,59.8 85.4,59.8 86.4,59.8 84.5,58.8 85.4,58.8 86.4,58.8 84.5,57.8 85.5,57.8 86.4,57.8 12.4,66.9 25.7,35.3 28.6,35.3 25.5,22.1 28.5,22.1 25.2,8.6 28.6,8.6 37.8,27.4 37.8,24.4 57.1,27.2 57.1,24.3 70,37 78.4,60.6
  pour Top (isolate 0.254, rank 3, no thermals): -2,99 102,99 102,-4 -2,-4
  pour Bottom (isolate 0.254, rank 3, no thermals): -3,100 -3,-5 104,-5 104,100
HOTBED  (via drill 0.3)
  Top 0.203: 28.17,19.7 HOTBED1.G 28.4,19.7 29.9,21.2 29.9,23.9 31,25 31.77,25 RG_B.1 31.85,27.69 HOTBED.1 35,30.84 v35,31 | IC1.14 v40.6,35.4
  Bottom 0.203: v35,31 37,33 39,33 40.6,34.6 v40.6,35.4
HOTEND  (via drill 0.3)
  Top 0.203: 27.16,32.87 HOTEND1.G 27.12,32.37 RG_E.1 32.3,32.6 v33.9,32.6 | IC1.13 v39.79,34.79
  Top 0.254: HOTEND.1 27.3,28.3 29,30 29,31 27.16,32.84 27.16,32.87
  Bottom 0.203: v33.9,32.6 36.1,32.6 36.85,33.36 38.36,33.36 v39.79,34.79
M0.0  (via drill 0.35)
  Top 0.152: v28.54,74.56 28.63,74.64 X_AXIS.M0
  Top 0.2: X_AXIS.M0
  Bottom 0.152: X31.1 28.12,70.12 28.12,74.13 v28.54,74.56
M0.1  (via drill 0.35)
  Top 0.152: v49.4,74.2 49.44,74.24 Y-AXIS.M0
  Bottom 0.152: v49.4,74.2 48.93,73.73 48.93,69.93 X33.1
M0.2  (via drill 0.35)
  Top 0.152: v69.5,74.4 69.64,74.54 Z_AXIS.M0
  Bottom 0.152: X35.1 67,69.31 66.02,70.29 66.02,71.42 66.8,72.2 67.3,72.2 v69.5,74.4
M0.3  (via drill 0.3)
  Top 0.152: EXT_1.M0 90,77.25 v90,75
  Bottom 0.152: v90,75 90,74.54 89.45,73.99 86.99,73.99 83.23,70.23 81.61,70.23 81.07,69.69 81.07,68.57 X37.1
M0.4
  Top 0.152: X39.1 73.02,57.18 74.11,57.18 74.75,56.55 74.75,55.35 75.7,54.4 79.4,54.4 81.86,56.86 EXT_2.M0
M1.0  (via drill 0.35)
  Top 0.152: X_AXIS.M1 v28,75.4
  Top 0.2: X_AXIS.M1
  Bottom 0.152: v28,75.4 28,74.87 26.02,72.89 26.02,70.02 X31.2
M1.1  (via drill 0.35)
  Top 0.152: v48.8,75.2 Y-AXIS.M1
  Bottom 0.152: v48.8,75.2 48.8,74.46 47,72.66 47,70 X33.2
M1.2  (via drill 0.35)
  Top 0.152: v68.9,75.3 68.99,75.39 Z_AXIS.M1
  Bottom 0.152: v68.9,75.3 65.53,71.93 64.61,71.93 64.07,71.39 64.07,70.61 65,69.68 X35.2
M1.3  (via drill 0.3)
  Top 0.152: EXT_1.M1 89.39,76.29 89.21,76.11 v89.21,74.57
  Bottom 0.152: X37.2 78.82,68.32 78.82,69.71 79.69,70.58 82.88,70.58 86.87,74.57 v89.21,74.57
M1.4
  Top 0.152: X39.2 73.02,59.18 74.41,59.18 75.2,58.39 75.2,55.53 76.02,54.72 79,54.72 81.79,57.51 82,57.51 EXT_2.M1
  Top 0.254: EXT_2.M1 82,57.51 | 82,57.51
MISO  (via drill 0.3, 0.35)
  Top 0.152: IC1.2 36.88,46.52 36.05,46.52 32.95,49.62 25.42,49.62 ISP.6 | 38.14,46 38.75,45.39 40.61,45.39 v41,45 | v43.3,43.3 43.74,43.3 47.95,47.5 53.31,47.5 | v58.4,44.7 58.4,43.6 58.9,43.1 58.9,40.28 v58.62,40
  Top 0.203: IC1.2 37.4,46 38.14,46 | v53.5,47.69 53.31,47.5
  Bottom 0.152: v53.5,47.69 56.61,47.69 58.4,45.9 v58.4,44.7 | SD.DAT0 66.81,23.19 62,28 62,36.62 59.44,39.18 59.31,39.31 v58.62,40 | v41,45 42.7,43.3 v43.3,43.3 | v58.62,40
  Bottom 0.254: SD.DAT0 72.86,18.29 USD.7
MOS-1  (via drill 0.3)
  Top 0.152: X5.1 57.7,53.4 v57.7,41.6 | v57,38 57.92,37.08 v58.62,37.08 | v57.7,32.3 48.48,32.3 v48,31.82 | v44,29 42,27 40.4,27
  Top 0.203: RG_1.1 40.4,28.05 40.4,27 MOS11.G 46,20.21 46,18 47,17 48,17 48.81,16.19 MOS_1.1
  Bottom 0.152: v57.7,41.6 57.7,38.7 v57,38 | v58.62,37.08 58.62,33.22 v57.7,32.3 | v48,31.82 46.82,31.82 v44,29
MOS-2  (via drill 0.3, 0.35)
  Top 0.152: v69,52 72.6,48.4 72.6,40.3 72.42,40.3 71.05,38.92 68.92,38.92 v68.5,38.5 | v64,34 64,32.52 64.78,31.74 64.78,30.66 62.92,28.8 61.47,28.8 59.67,27
  Top 0.203: MOS_2.1 49.36,22 57,22 59.7,24.7 MOS22.G 59.67,26.06 59.67,27 RG_2.1
  Bottom 0.152: X3.1 69,52.7 v69,52 | v68.5,38.5 v64,34
MOSI  (via drill 0.3)
  Top 0.152: ISP.3 21.57,50.49 22.2,49.86 24.52,49.86 24.58,49.92 33.08,49.92 36,47 IC1.1 38.6,47 39,46.6 v39,46 | LEVEL_SHIFTER.3 69.51,17.25 66.27,20.49 66.27,22.83 v66.1,23
  Bottom 0.152: v66.1,23 65.05,24.05 55.09,34.01 46.02,34.01 40.74,39.3 39.08,39.3 38.7,39.68 38.7,42.3 39,42.6 v39,46 | v66.1,23
MOSI_3V3  (via drill 0.3)
  Top 0.254: LEVEL_SHIFTER.2 73.88,18.52 76,16.4 v76,15
  Bottom 0.254: SD.CMD 69.59,10.59 72.89,13.89 77,13.89 | USD.3 77,13.89 | 77,13.89 76,14.89 v76,15
N$1
  Top 0.152: 47.57,56 DBR1.1
  Top 0.2: E1_THERM.1 48.01,58.19 DBC1.1 47.57,56
N$2
  Top 0.2: E2_THERM.1 54.62,60.89 DBR0.1 54.69,60.9 DBC0.1
N$3
  Top 0.152: 12.42,68.84 12.42,68.87 SUPPLY.3 12.45,71.82 12.81,72.19 | 12.89,72.36 REN1.1 12.81,72.19 | REN2.2 12.64,72.36 12.81,72.19
N$4
  Bottom 0.254: USB1.1 85.32,34 USB.1
N$5
  Top 0.406: Y-AXIS.AOUT1 48.79,84.79 49.63,85.63 49.63,90.46 MOT_Y.1
N$6
  Top 0.406: MOT_Y.2 47.44,90.81 47.44,84.69 47.49,84.64 Y-AXIS.AOUT2
N$9
  Top 0.254: X_AXIS.AOUT1 27.99,83
  Top 0.406: MOT_X.1 29.64,88.44 28.74,88.44 28.3,88 28.3,84.83 27.99,84.52 27.99,83 X_AXIS.AOUT1
N$10
  Top 0.406: X_AXIS.AOUT2 26.69,88.09 29.76,91.16 MOT_X.2
N$13
  Top 0.406: Z_AXIS.AOUT1 68.99,84.27 69.21,84.48 69.21,85.11 68.99,85.33 68.99,87.11 MOT_Z.7 MOT_Z.8
N$14
  Top 0.406: Z_AXIS.AOUT2 67.69,88.35 MOT_Z.5 MOT_Z.6
N$17
  Top 0.406: EXT_1.AOUT1 89.39,84.99 89.6,85.2 89.6,90.24 E1.1
N$18
  Top 0.406: E1.2 87.08,89.56 88.19,88.45 88.19,85.96 88.04,85.81 88.04,85.08 88.09,85.04 EXT_1.AOUT2
N$21
  Top 0.406: EXT_2.AOUT2 92.92,58.81 E2.2
N$22
  Top 0.254: E2.1 92.98,56.89 92.89,56.89
  Top 0.406: E2.1 93.17,56.61 92.89,56.89 92.27,57.51 90.82,57.51 90.53,57.22 89.88,57.22 89.58,57.51 EXT_2.AOUT1
N$25
  Top 0.152: RRT.2 11.13,69.16 SUPPLY.5
N$26
  Top 0.508: MOS_2.3 53.83,19.17 57.27,15.73 | 58,15 57.27,15.73 | 57.27,15.73 MOS22.D
  pour Top (isolate 0.254, no thermals): 51,21 64,21 64,4 62,2 58,2 57,3 57,9 56,10 51,10
N$29
  Top 0.152: X_AXIS.V3P3 22.14,75.56 22.58,75.12 RVREF0.1 22.58,73 22.55,72.97 CDEC0.3.1
N$30
  Top 0.152: Y-AXIS.V3P3 42.94,75.27 RVREF1.1 42.06,71.43 CDEC1.3.1
N$31
  Top 0.305: 88.38,56.14 EXT_2.VCP 88.43,56.09 89.19,56.09 89.82,55.45 89.82,54.7 90.46,54.06 CPO4.1
N$32
  Top 0.305: 87.71,53.22 CP4.1 87.88,54.48 EXT_2.CPL
N$33
  Top 0.305: 88.38,55.49 EXT_2.CPH 88.43,55.44 89.19,55.44 89.36,55.26 89.36,54.51 89.58,54.29 CP4.2 89.45,53.05
N$34
  Top 0.152: Z_AXIS.V3P3 63.14,73.72 62.91,73.49 RVREF2.1 61.91,71.92 CDEC2.3.1
N$35
  Top 0.152: EXT_2.V3P3 81.92,63.95 79,63.95 CDEC4.3.1 76.96,61.91 RVREF4.1
N$36
  Top 0.305: CPO3.1 91.06,84.14 90.99,84.14 90.69,83.85 EXT_1.VCP
N$37
  Top 0.305: EXT_1.CPL 93.18,83.09 CP3.1
N$38
  Top 0.254: CP3.2 93,81.66
  Top 0.305: EXT_1.CPH 91.46,82.97 91.46,82.21 92.01,81.66 93,81.66 CP3.2
N$39
  Top 0.152: EXT_1.V3P3 81.16,77.29 RVREF3.1 81.06,75.83 CDEC3.3.1
N$40
  Top 0.254: X_AXIS.VCP 29.21,83.01
  Top 0.305: X_AXIS.VCP 29.36,83 29.36,83.86 30.2,84.7 30.2,85.21 CPO0.1
N$41
  Top 0.305: X_AXIS.CPL 31.78,84.12 CP0.1
N$42
  Top 0.305: X_AXIS.CPH 30.06,82.81 30.06,82.05 30.24,81.88 30.94,81.88 31.49,82.42 CP0.2
N$44
  Top 0.508: MOS_FAN.3 18.37,8.61 MOS_FAN1.D
  pour Top (isolate 0.254, no thermals): 22,15 11,15 9.7,13.7 9.7,8.6 9.8,8.5 3.5,8.5 2,7 2,4 3.6,2.4 21.9,2.4 22,2.5
N$45
  Top 0.508: MOS_1.3 39.94,13.47 MOS11.D
  pour Top (isolate 0.254, no thermals): 31.5,20.7 44.2,20.7 44.2,3.3 43,2.1 39,2.1 38,3.1 38,9.3 37.4,9.9 31.5,9.9
N$46
  Top 0.305: 50.16,83.12 Y-AXIS.VCP 50.09,83.56 50.21,83.68 50.21,83.93 50.39,84.11 50.63,84.11 CPO1.1
N$47
  Top 0.305: Y-AXIS.CPL 51.98,83.64 CP1.1
N$48
  Top 0.305: 50.81,83.12 Y-AXIS.CPH 50.86,82.93 50.86,82.17 51.09,81.94 CP1.2
N$49
  Top 0.508: HOTEND1.D 18.62,35.1 HOTEND.3
  pour Top (isolate 0.254, no thermals): 22,41.6 10.6,41.6 10,41 10,35 3,35 2,34 2,31 4,29 22,29
N$50
  Top 0.305: CPO2.1 71.56,84.56 71.03,84.03 70.59,84.03 70.29,83.73 Z_AXIS.VCP
N$51
  Top 0.305: CP2.1 72.82,84.2 72.28,83.66 72.12,83.66 71.94,83.48 71.94,83.33 Z_AXIS.CPL
N$52
  Top 0.305: 71.01,83.04 Z_AXIS.CPH 71.06,82.85 71.06,82.09 71.24,81.92 71.94,81.92 72.53,82.5 CP2.2
N$53
  Top 0.508: HOTBED.3 27.61,26.6 21.07,26.6 HOTBED1.D
  pour Top (isolate 0.254, no thermals): 22.1,28.6 11.2,28.6 9.8,27.2 9.8,22.5 9,21.7 2.4,21.7 1.7,21 1.7,17 2.7,16 22,16 22,28.5
N$54
  Top 0.2: IC1.7 32.63,42.2 31.46,43.37 31.46,44.62 31.32,44.77 30.06,44.77 X1.X1
  Top 0.203: X1.X1 C_Q1.1
N$55
  Top 0.2: IC1.8 32.93,41.4 31.11,43.22 31.11,43.32 X1.X2 30.61,41.47 C_Q2.2
N$57
  Top 0.152: CSS.2 11.95,69.9 SUPPLY.4
N$58
  Top 0.305: SUPPLY.1 15.83,71.22 CB.1
N$59
  Top 0.152: RCOMP.1 11,60.94 CCOMP1.2
N$60  (via drill 0.3)
  Top 0.406: Y-AXIS.AISEN 48.14,85.34 v48.2,85.4
  Bottom 0.406: v48.2,85.4 48.94,86.14 AISEN1.1
N$61  (via drill 0.3)
  Top 0.406: Y-AXIS.BISEN 46.19,85.21 v46,85.4
  Bottom 0.406: v46,85.4 45.66,85.74 BISEN1.1
N$62  (via drill 0.3)
  Top 0.406: Z_AXIS.AISEN 68.34,84.69 v68.45,84.8
  Bottom 0.406: AISEN2.1 68.98,85.78 68.5,85.3 68.5,84.85 v68.45,84.8
N$63  (via drill 0.3)
  Top 0.406: Z_AXIS.BISEN 66.37,82.99 66.37,84.83 v66.2,85
  Bottom 0.406: v66.2,85 66.2,86.03 BISEN2.1
N$64  (via drill 0.3)
  Top 0.406: EXT_1.AISEN 88.74,85.44 v88.8,85.5
  Bottom 0.406: AISEN3.1 88.86,85.44 v88.8,85.5
N$65  (via drill 0.3)
  Top 0.406: EXT_1.BISEN 86.79,85.1 v86.67,85.1
  Bottom 0.406: v86.67,85.1 86.77,85.1 86.77,85.42 BISEN3.1
N$66  (via drill 0.35)
  Top 0.406: EXT_2.AISEN 90.04,58.16 v90.2,58
  Bottom 0.406: 90.36,55.51 AISEN4.1 90.2,55.53 v90.2,58
N$67  (via drill 0.35)
  Top 0.406: v90.48,60.24 90.35,60.11 EXT_2.BISEN
  Bottom 0.406: BISEN4.1 90.48,61.59 90.48,61 v90.48,60.24 | v90.48,60.24
N$68  (via drill 0.3)
  Top 0.406: X_AXIS.AISEN 27.34,84.94 v27.5,85.1
  Bottom 0.406: v27.5,85.1 27.9,85.5 AISEN0.1
N$69  (via drill 0.3)
  Top 0.254: X_AXIS.BISEN
  Top 0.406: X_AXIS.BISEN 25.37,82.95 25.37,84.49 25.3,84.56 v25.3,85.2
  Bottom 0.406: BISEN0.1 v25.3,85.2
N$70  (via drill 0.3, 0.35)
  Top 0.152: T4.3 76.61,57.39 RVREF4.2 76.61,60.31 77.8,61.5 80.8,61.5 v81.01,61.29 | EXT_2.VREF 87.47,64.2 v87.3,64.2
  Bottom 0.152: v81.01,61.29 81.72,62 83.92,62 86.12,64.2 v87.3,64.2
N$71  (via drill 0.3)
  Top 0.152: RVREF3.2 78.36,76.19 75.28,76.19 74.28,76.19 74.59,76.5 v74.59,78.3 v74.6,78.3 | EXT_1.VREF 83.2,82.75 v83.2,81.4
  Top 0.406: T3.3 75.12,76.19 75.28,76.19
  Bottom 0.152: v83.2,81.4 82.11,80.31 79.87,80.31 78.87,79.3 75.6,79.3 v74.6,78.3
N$72  (via drill 0.3)
  Top 0.152: T0.3 17.65,73.57 RVREF0.2 20.82,73.62 | 20.82,73.62 20.6,73.85 | X_AXIS.VREF 22.14,82.04 v21.5,81.4 | v20.3,76.6 20.82,76.08 20.82,73.62
  Bottom 0.152: v21.5,81.4 21.5,78.93 20.7,78.13 20.7,77 v20.3,76.6
N$73  (via drill 0.3)
  Top 0.152: T1.3 37.22,75.01 37.84,74.39 RVREF1.2 40.33,74.42 | 40.33,74.42 40.06,74.69 | Y-AXIS.VREF 43,82.99 43,81.8 v42.6,81.4 | 40.33,74.42 40.33,76.79 40.06,77.06 40.06,77.96 v40.5,78.4
  Bottom 0.152: v42.6,81.4 42.6,80.5 v40.5,78.4
N$74  (via drill 0.3)
  Top 0.152: T2.3 57.01,73.81 57.33,73.49 RVREF2.2 60.36,73.64 60.3,73.7 v60.3,76.6 | Z_AXIS.VREF 63.14,81.64 v62.7,81.2
  Bottom 0.152: v62.7,81.2 62.5,81 62.5,80.41 60.7,78.6 60.7,77 v60.3,76.6
N$75
  Top 0.152: SUPPLY.8 12.45,62.13 12.4,62.09 12.41,60.24 11.58,59.42 CCOMP.2 11.45,59.24 RCOMP.2 | 10.27,59.24 RCOMP.2 | 11.41,59.24 RCOMP.2
N$76
  Top 0.2: IC1.29 54.65,43.8 CDECREF1.2
N$77  (via drill 0.35)
  Top 0.305: 15.89,62.4 SUPPLY.10 | D1.C 15.89,62.4 | 15.89,62.4 15.89,63.89 v16,64 | v17,69 16.37,69.63 CB.2
  Bottom 0.305: v16,64 16,68 v17,69
  pour Top (isolate 0.254, no thermals): 13,66 13,63 15,61 15,59 14,58 4,58 4,50.5 18,50.5 18,55 21,58 21,65 20,66
N$78
  Top 0.2: B_THERM.1 40.68,60.83 DBR2.1 40.49,63.21 DBC2.1
N$79
  Top 0.152: SUPPLY.7 11.83,64.72 11.83,64.02 11.57,63.76 RF2.2 7.81,61.66 RF1.1
RESET  (via drill 0.3)
  Top 0.152: ISP.2 25.72,53.39 RESET.2 30.42,58.09 PUP_RES.1 | v35,46.7 35.1,46.7 35.12,46.68 35.12,45.36 35.56,44.92 36.88,44.92 IC1.4
  Bottom 0.152: v35,46.7 29.83,51.87 RESET.2
  Bottom 0.2: RESET.1 RESET.2
RX  (via drill 0.3)
  Top 0.2: FT232.1 75.88,29.88 75.35,29.35 66.65,29.35 66,30 66,33 64.1,34.9 v55.1,34.9 | v40.6,40.6 IC1.9
  Bottom 0.2: v55.1,34.9 52,38 43.6,38 41,40.6 v40.6,40.6
SCK  (via drill 0.3)
  Top 0.152: IC1.3 35.9,45.4 v35.7,45.6 | LEVEL_SHIFTER.7 71.39,12.89 70.59,12.89 65,18.48 65,21.6 v64.3,22.3
  Bottom 0.152: ISP.4 29.45,50.85 34.7,45.6 v35.7,45.6 35.7,39.3 39,36 41.67,36 44.97,32.7 49.48,32.7 49.76,32.42 50.24,32.42 50.52,32.7 53.91,32.7 v64.3,22.3
SCK_3V3  (via drill 0.3)
  Top 0.254: v70,14.3 70.86,13.45 LEVEL_SHIFTER.6
  Bottom 0.254: 70.06,16.09 SD.CLK | USD.5 70.06,16.09 | 70.06,16.09 70.06,14.36 v70,14.3
SCL  (via drill 0.3)
  Top 0.152: LCD_ENC.2 93.65,46 91.54,46 90.96,45.42 77.32,45.42 v77.1,45.2 | v43.95,34.75 44.6,35.4 IC1.19 | v63,33 v50,33
  Bottom 0.152: v77.1,45.2 77.1,43.6 74.92,41.42 74.92,40.26 67.66,33 v63,33 | v43.95,34.75 43.95,34.15 45.1,33 v50,33
SD-CS  (via drill 0.3)
  Top 0.152: LEVEL_SHIFTER.5 71.39,15.43 70.91,15.43 65.6,20.73 v65.6,22 | IC1.37 44.6,45.9 41.1,42.4 41.1,40.92 41.18,40.84 41.18,39.38 v40.51,38.71
  Bottom 0.152: v65.6,22 54,33.6 45.91,33.6 40.81,38.71 v40.51,38.71
SDA  (via drill 0.3)
  Top 0.152: LCD_ENC.4 91.11,46 v78,46 | v63.8,36.5 52.8,36.5 v51.9,35.6 | IC1.20 45.4,35.5 v45.6,35.3
  Bottom 0.152: v78,46 76,46 74.6,44.6 69.8,44.6 63.8,38.6 v63.8,36.5 | v51.9,35.6 51.59,35.3 v45.6,35.3
STOPX  (via drill 0.3)
  Top 0.152: ENDSTOP.2 69.95,39.23 DBC3.1 62.28,39.23 | 61.12,39.28 v60.7,39.7
  Top 0.2: 62.28,39.23 DBR3.1 61.12,39.28 | v50.6,44.5 48.9,44.5 IC1.30
  Bottom 0.152: v60.7,39.7 57.95,42.45 53.05,42.45 51,44.5
  Bottom 0.2: 51,44.5 v50.6,44.5
STOPY  (via drill 0.3)
  Top 0.152: 71.2,43.02 DBC4.1 65.52,42.97 62,42.97
  Top 0.2: ENDSTOP.4 71.2,43.02 | DBR4.1 62,42.97 60.97,42.97 v60.8,42.8 | v50.6,45.4 IC1.31
  Bottom 0.152: v60.8,42.8 53.2,42.8 v50.6,45.4
STOPZ  (via drill 0.3)
  Top 0.2: ENDSTOP.6 68.19,45.75 DBC5.1 65.52,48.42 DBR5.1 62.05,48.3 v60.8,48.3 | v50.6,46.26 48.86,46.26 IC1.32
  Bottom 0.2: v60.8,48.3 52.64,48.3 v50.6,46.26
T0.0  (via drill 0.35)
  Top 0.152: v31.01,75.31 30.81,75.31 29.94,76.18 X_AXIS.TRQ0
  Bottom 0.152: X32.1 31.1,69.31 32.08,70.29 32.08,74.23 v31.01,75.31
T0.1  (via drill 0.35)
  Top 0.152: v50.8,74.2 50.8,77.19 Y-AXIS.TRQ0
  Bottom 0.152: v50.8,74.2 50.8,71.82 51.23,71.39 51.23,70.07 X34.1
T0.2  (via drill 0.35)
  Top 0.152: v70.9,74.4 70.9,77.13 Z_AXIS.TRQ0
  Bottom 0.152: v70.9,74.4 70.9,72.02 70.27,71.39 70.27,69.93 X36.1
T0.3  (via drill 0.35)
  Top 0.152: EXT_1.TRQ0 91.3,77.25 91.3,75.96 91.31,75.95 91.31,75.45 91.3,75.44 v91.3,74.8
  Bottom 0.152: X38.1 84.8,67.3 86.31,68.81 86.31,72.31 87.38,73.38 89.88,73.38 v91.3,74.8
T0.4
  Top 0.152: 82.36,55.56 EXT_2.TRQ0 81.56,55.56 79.79,53.79 75.57,53.79 74.78,53 73.2,53 X40.1
T1.0  (via drill 0.35)
  Top 0.152: v29.24,75.3 29.24,77.08 29.26,77.1
  Top 0.2: X_AXIS.TRQ1 29.26,77.1
  Bottom 0.152: v29.24,75.3 29.1,75.16 29.1,74.86 30.08,73.88 30.08,70.29 29.1,69.31 X32.2
T1.1  (via drill 0.35)
  Top 0.152: v50.05,75.1 50.05,77.21 Y-AXIS.TRQ1
  Bottom 0.152: X34.2 49.37,69.93 49.37,71.39 50.05,72.07 v50.05,75.1
T1.2  (via drill 0.35)
  Top 0.152: v70.25,75.3 70.25,77.13 Z_AXIS.TRQ1
  Bottom 0.152: 70.2,75.25 v70.25,75.3 70.11,75.16 70.11,74.15 68,72.04 68,70 69,69 X36.2
T1.3  (via drill 0.35)
  Top 0.152: v90.7,75.7 EXT_1.TRQ1
  Bottom 0.152: X38.2 82.68,67.3 83.61,68.23 84.83,68.23 86,69.41 86,72.57 87.12,73.69 89.58,73.69 90.58,74.69 90.58,74.89 90.69,75 | v90.7,75.7 90.7,75.06 90.69,75.05 90.69,75 | 90.69,75 90.69,74.62
T1.4
  Top 0.152: EXT_2.TRQ1 82.51,56.1 81.6,56.1 79.59,54.09 75.41,54.09 74.28,55.22 72.69,55.22 72,55.91 X40.2
TOFF.0  (via drill 0.3)
  Top 0.152: X_AXIS.TOFF 22.99,76.93 22.99,76.28 23.77,75.51 v23.77,74.7
  Bottom 0.152: SJ3.2 21,72.83 21.29,73.12 22.82,73.12 23.79,74.08 | 23.79,74.08 23.79,74.68 v23.77,74.7 23.77,74.11 23.79,74.08
TOFF.1  (via drill 0.3)
  Top 0.152: Y-AXIS.TOFF 43.59,76.32 43.59,74.83 43.59,73.59 v43.4,73.4
  Bottom 0.152: SJ7.2 41,73 41.4,73.4 v43.4,73.4
TOFF.2  (via drill 0.3)
  Top 0.152: Z_AXIS.TOFF 63.79,75.05 v64.39,74.44
  Bottom 0.152: v64.39,74.44 63.35,73.4 61.7,73.4 61,72.7 SJ11.2
TOFF.3  (via drill 0.3)
  Top 0.152: EXT_1.TOFF v84.19,75.71 v84.2,75.7
  Bottom 0.152: v84.2,75.7 81.53,75.7 81.2,76.03 79.84,76.03 78.71,74.89 78.71,74.21 78.8,74.3 SJ16.2
TOFF.4  (via drill 0.35)
  Top 0.152: EXT_2.TOFF 81.76,62.7 80.85,63.61 80.35,63.61 79.99,63.25 79.99,62.75 80,62.74 80,62.7 v79.76,62.46
  Bottom 0.152: SJ19.2 79.4,62.1 v79.76,62.46
TX  (via drill 0.3)
  Top 0.2: FT232.5 73.28,33.24 70.92,35.6 v53.2,35.6 | v40,39.9 37.3,39.9 IC1.10
  Bottom 0.152: v40,39.9 40.8,39.9
  Bottom 0.2: v53.2,35.6 51.15,37.65 43.05,37.65 40.8,39.9 v40,39.9
VIN  (1 unrouted)
  Top 0.254: 12.97,68.86 SUPPLY.2 12.95,69.95 | 12.95,69.75 12.95,69
  Top 0.305: 12.95,69 SUPPLY.2
  Top 0.406: CDEC0.1.1 23.94,84.55 23.94,84.27 24.09,84.12 X_AXIS.VM1 | 13,69.8 12.95,69.75
  Top 0.508: 16.61,83.74 CDEC0.2.+ | 8.97,77.81 7805.1 10.01,78.85 | REN1.2 14.64,71.64 12.95,69.95 12.95,69.79
  Top 0.61: REN1.2 14.64,73.87 SWT_CIN.2 12.86,74.88 9.95,77.79 7805.1 8.95,81.09 LDOCIN.1
  pour Top (isolate 0.254, rank 2, no thermals): 89,51 100,51 100,99 89,99
  pour Bottom (isolate 0.254, rank 2, no thermals): 17,99 -1,99 -1,-1 64,-1 64,11 12,11 12,86 17,86
  pour Top (isolate 0.254, no thermals): 99,98 99,82 16,82 15,83 15,86 17,88 17,98
X-DIR
  Top 0.152: IC1.44 36.7,51.1 36.7,67.13 30.18,73.65 28.16,73.65 26.69,75.12 X_AXIS.DIR
X-STEP
  Top 0.152: X_AXIS.STEP 27.39,77.08 27.39,74.85 28.29,73.95 30.52,73.95 37,67.47 37,54 39.8,51.2 IC1.43
XYE_EN  (via drill 0.3, 0.35)
  Top 0.152: X_AXIS.ENABLE 25.97,77.06 v25.97,75.7 | v40.64,77.3 41.78,77.3 v42.08,77 | v46.7,75.3 46.84,75.44 Y-AXIS.ENABLE | v54,73 54,67 56.67,64.33 57.06,64.33 57.6,63.78 v57.6,62.1 57.6,58.4 58.3,57.7 64,57.7 X3.2 | EXT_1.ENABLE 87.24,77.09 87.24,75.16 83.19,71.11 76.97,71.11 76.19,70.32 76.19,67.31 v75.75,66.87 | IC1.40 42.2,50.5 v42.3,50.6
  Bottom 0.152: v25.97,75.7 27.57,77.3 v40.64,77.3 | v42.08,77 45,77 v46.7,75.3 47.4,76 52,76 54,74 v54,73 | X3.2 66.9,58.7 72.19,63.99 75.88,63.99 76.41,64.52 76.41,65.28 76.4,65.29 76.4,65.94 75.75,66.58 v75.75,66.87 | v42.3,50.6 46.1,50.6 v57.6,62.1
Y-DIR  (via drill 0.3)
  Top 0.152: v45,58 46,59 46,65 47,66 53,66 53.28,66.28 53.28,67.41 53.23,67.46 53.23,71.39 51.33,73.29 49.02,73.29 47.49,74.82 Y-AXIS.DIR | v40.5,50.7 40.5,48.9 IC1.42
  Bottom 0.152: v45,58 40.5,53.5 v40.5,50.7
Y-STEP  (via drill 0.3)
  Top 0.152: v49.4,55.6 50.1,56.3 50.1,58.37 50,58.47 50,65 50.7,65.69 53.13,65.69 53.59,66.16 53.59,71.46 51.46,73.59 49.15,73.59 48.14,74.6 Y-AXIS.STEP | v41.4,51.4 IC1.41
  Bottom 0.152: v49.4,55.6 45.2,51.4 v41.4,51.4
Z-DIR  (via drill 0.3)
  Top 0.152: Z_AXIS.DIR 67.69,73.08 66.02,71.41 66.02,65.82 X29.2 62,61.8 60,61.8 59.5,61.3 v59.5,60.4 | IC1.26 46.6,41.4 v46,42
  Bottom 0.152: v46,42 46,46.3 59.5,59.8 v59.5,60.4
Z-EN  (via drill 0.3)
  Top 0.152: Z_AXIS.ENABLE 67.04,74.43 64.02,71.41 64.02,65.02 63,64 62,64 61,63 X4.2 | IC1.16 42.2,40.4 v42.28,40.48
  Bottom 0.152: X4.2 60.1,61.9 59,61.9 44.58,47.48 44.58,40.96 44.04,40.42 42.34,40.42 v42.28,40.48
Z-STEP  (via drill 0.3)
  Top 0.152: IC1.25 46,40.6 v45.7,40.9 | Z_AXIS.STEP 68.34,75.6 68.27,75.53 68.27,66.07 X6.2 63.93,61.73 63.93,60.41 63.32,59.8 58.68,59.8 v58.49,59.61
  Bottom 0.152: v45.7,40.9 45.4,41.2 45.4,46.5 57.95,59.05 58.49,59.59 | 58.49,59.59 v58.5,59.6 v58.49,59.61 58.49,59.59

## Text on the board
Top: Se 2.0 muovere questo condensatore
tNames: GND | M1-M0 | 5V | 5V | 5V | T1-T0 | M1-M0 | T1-T0 | T1-T0 | T1-T0 | M1-M0 | GND | GND | M1-M0 | 5V | GND | 5V | S | S | S | M1 / M0 / T1 / T0 | Z-EN | E2-EN | E2.STP | Z-DIR / E2-DIR / E2-DIR | GND | MOS1 | Z-STEP / E2-STEP / XYE_EN / MOS2 | Z | Y | X | Engineered by: Marco Giordano / Approved on: 22-10-18